# Altium project POWERDIST_DARNET_2022.PrjPcb
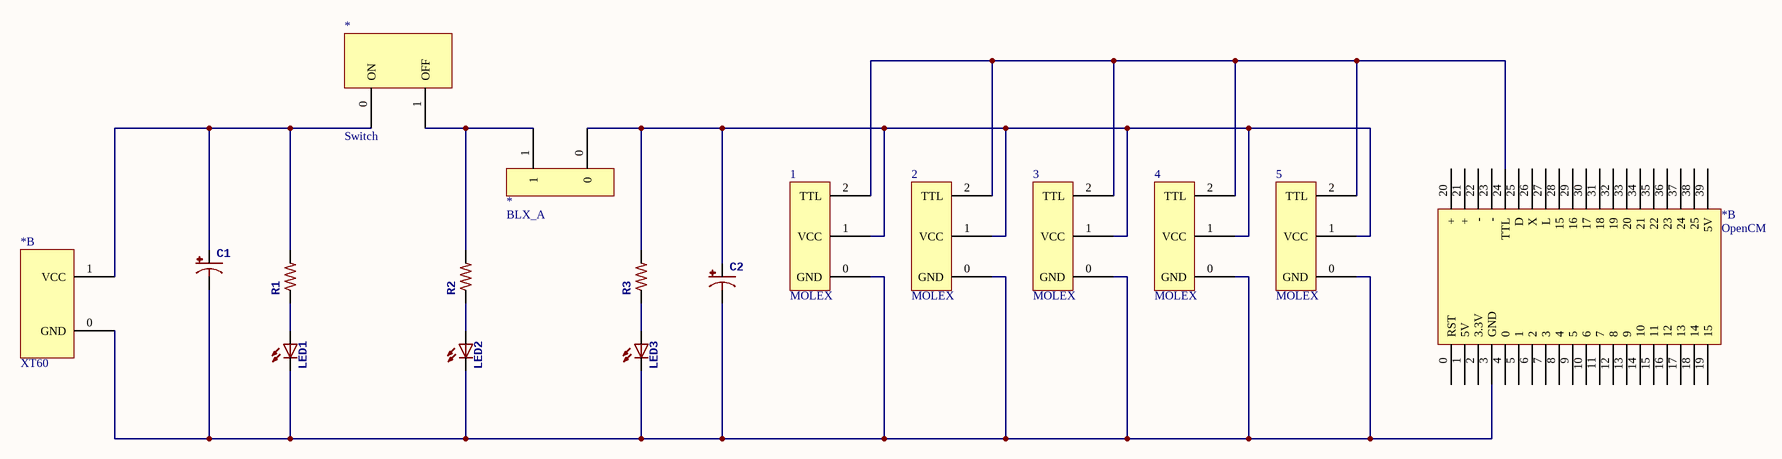
[diagram p0: POWERDIST_DARNET_2022.SchDoc]
1 sheet, 17 parts. Net scope: global (net labels, ports and power ports of the same name join across sheets).
Board file: POWERDIST_DARNET_2022.PcbDoc

## Sheet POWERDIST_DARNET_2022.SchDoc
size B; SheetNumber: 1; SheetTotal: 1

### Parts
1  MOLEX  [MOLEX]
2  MOLEX  [MOLEX]
3  MOLEX  [MOLEX]
4  MOLEX  [MOLEX]
5  MOLEX  [MOLEX]
C1  (no value)  [CPOL-RADIAL-10UF-25V]
C2  (no value)  [CPOL-RADIAL-10UF-25V]
Fuse  BLX_A  [BLX_A]
LED1  (no value)  [LED5MM]
LED2  (no value)  [LED5MM]
LED3  (no value)  [LED5MM]
OpenCM  OpenCM  [OpenCM]  (part B of 2)
R1  (no value)  [AXIAL-0.5]
R2  (no value)  [AXIAL-0.5]
R3  (no value)  [AXIAL-0.5]
Switch  Switch  [Switch]
XT60  XT60  [XT60]  (part B of 2)

### Nets
Net1_0: 1.0(GND) 2.0(GND) 3.0(GND) 4.0(GND) 5.0(GND) C1.2(-) C2.2(-) LED1.K(C) LED2.K(C) LED3.K(C) OpenCM.3(GND) XT60.0(GND)
Net1_1: 1.1(VCC) 2.1(VCC) 3.1(VCC) 4.1(VCC) 5.1(VCC) C2.1(+) Fuse.0 R3.P$2
Net1_2: 1.2(TTL) 2.2(TTL) 3.2(TTL) 4.2(TTL) 5.2(TTL) OpenCM.24(TTL)
NetC1_1: C1.1(+) R1.P$2 Switch.0(ON) XT60.1(VCC)
NetFuse_1: Fuse.1 R2.P$2 Switch.1(OFF)
NetLED1_A: LED1.A R1.P$1
NetLED2_A: LED2.A R2.P$1
NetLED3_A: LED3.A R3.P$1

Not connected (* = marked no-connect by the designer): OpenCM 0(RST) 1(5V) 2(3.3V) 4(0) 5(1) 6(2) 7(3) 8(4) 9(5) 10(6) 11(7) 12(8) 13(9) 14(10) 15(11) 16(12) 17(13) 18(14) 19(15) 20(+) 21(+) 22(-) 23(-) 25(D) 26(X) 27(L) 28(15) 29(16) 30(17) 31(18) 32(19) 33(20) 34(21) 35(22) 36(23) 37(24) 38(25) 39(5V)

### Library data of the parts
C1 C2 = CAP_POLPTH2
LED1-LED3 = LED5MM
R1-R3 = RESISTORPTH-1/2W